# Altium schematic sheet 电源.SchDoc
size A4
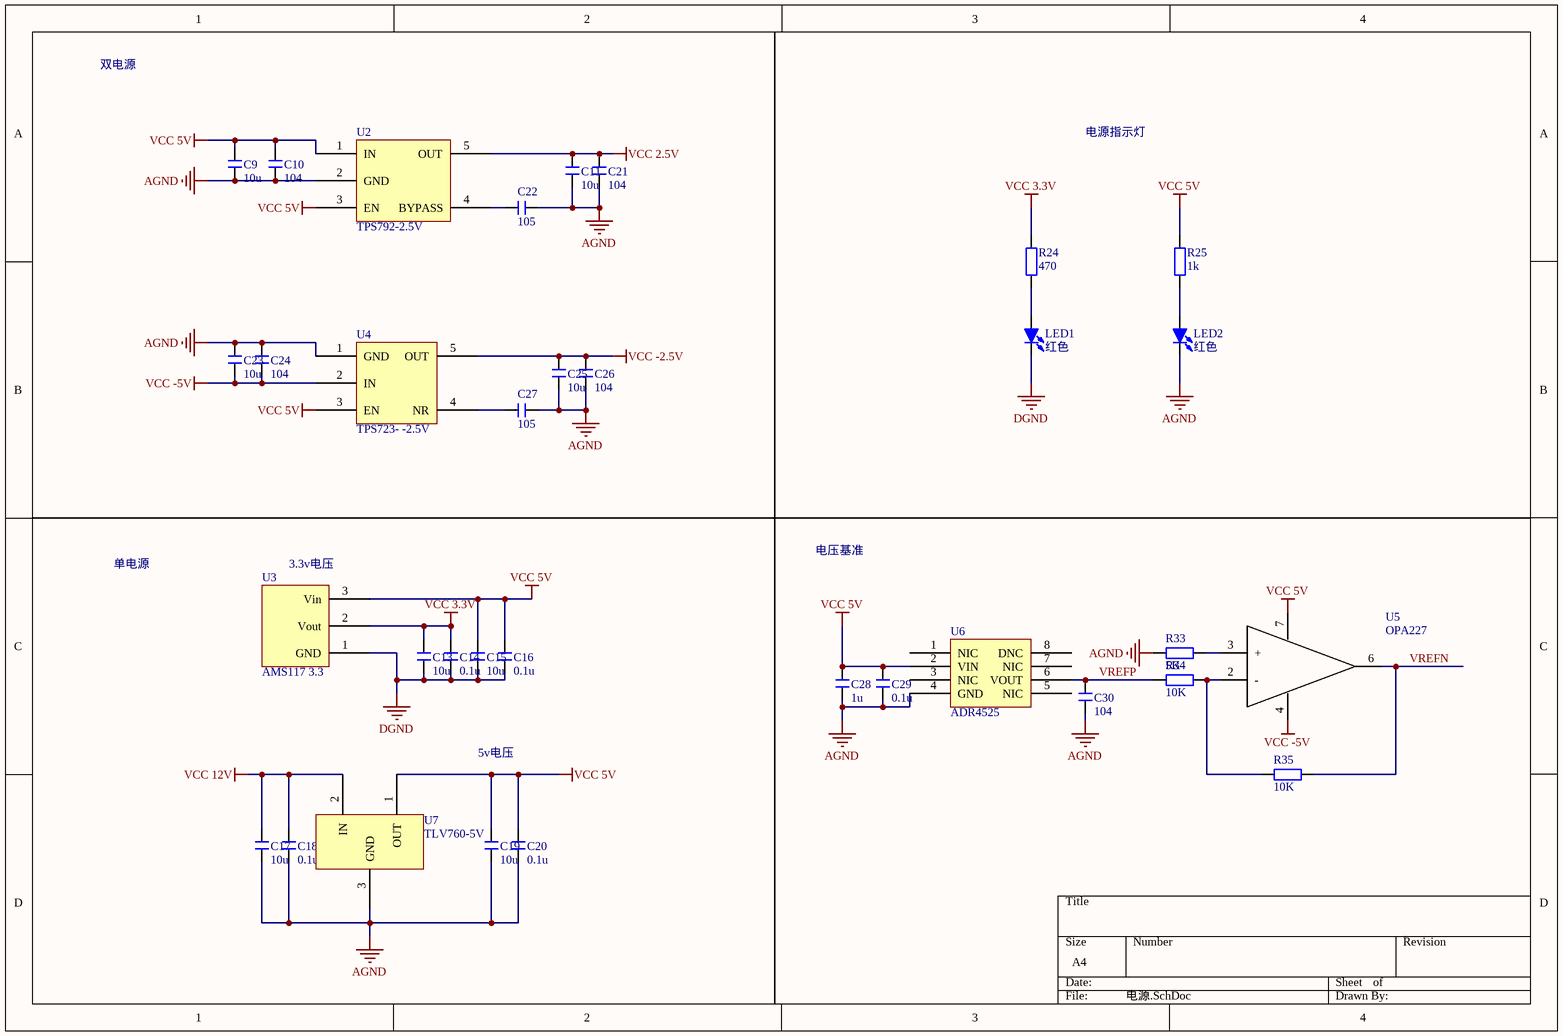
[diagram p0: 电源.SchDoc]

## Parts
C9  10u  [C 0805_L]
C10  104  [C 0805_L]
C11  10u  [C 0805_L]
C13  10u  [C 0805_L]
C14  0.1u  [C 0805_L]
C15  10u  [C 0805_L]
C16  0.1u  [C 0805_L]
C17  10u  [C 0805_L]
C18  0.1u  [C 0805_L]
C19  10u  [C 0805_L]
C20  0.1u  [C 0805_L]
C21  104  [C 0805_L]
C22  105  [C 0805_L]
C23  10u  [C 0805_L]
C24  104  [C 0805_L]
C25  10u  [C 0805_L]
C26  104  [C 0805_L]
C27  105  [C 0805_L]
C28  1u  [C 0805_L]
C29  0.1u  [C 0805_L]
C30  104  [C 0805_L]
LED1  红色  [LED 0805G]
LED2  红色  [LED 0805G]
R24  470  [R 0805_L]
R25  1k  [R 0805_L]
R33  5K  [R 0805_L]
R34  10K  [R 0805_L]
R35  10K  [R 0805_L]
U2  TPS792-2.5V  [SOT23-5N]
U3  AMS117 3.3  [SOT223_N]
U4  TPS723- -2.5V  [SOT23-5N]
U5  OPA227  [SOP8_N]
U6  ADR4525  [SOP8_N]
U7  TLV760-5V  [SOT23-3N]

## Nets
AGND: C9.1 C10.1 C11.1 C17.1 C18.1 C19.1 C20.1 C21.1 C22.2 C23.2 C24.2 C25.1 C26.1 C27.2 C28.1 C29.1 C30.1 LED2.2(K) R33.2 U2.2(GND) U4.1(GND) U6.4(GND) U7.3(GND)
DGND: C13.1 C14.1 C15.1 C16.1 LED1.2(K) U3.1(GND)
VCC 2.5V: C11.2 C21.2 U2.5(OUT)
VCC 3.3V: C13.2 C14.2 R24.2 U3.2(Vout)
VCC 5V: C9.2 C10.2 C15.2 C16.2 C19.2 C20.2 C28.2 C29.2 R25.2 U2.1(IN) U2.3(EN) U3.3(Vin) U4.3(EN) U5.7(VCC) U6.2(VIN) U7.1(OUT)
VCC 12V: C17.2 C18.2 U7.2(IN)
VCC -2.5V: C25.2 C26.2 U4.5(OUT)
VCC -5V: C23.1 C24.1 U4.2(IN) U5.4(VSS)
VREFN: R35.2 U5.6(UOT)
VREFP: C30.2 R34.1 U6.6(VOUT)
NetC22_1: C22.1 U2.4(BYPASS)
NetC27_1: C27.1 U4.4(NR)
NetLED1_1: LED1.1(A) R24.1
NetLED2_1: LED2.1(A) R25.1
NetR33_1: R33.1 U5.3(+)
NetR34_2: R34.2 R35.1 U5.2(-)

Not connected (* = marked no-connect by the designer): U6 1(NIC) 3(NIC) 5(NIC) 7(NIC) 8(DNC)

## Notes on the sheet
- 双电源
- 电源指示灯
- 单电源
- (near U3) 3.3v电压
- 电压基准
- 5v电压

## Library data of the parts
C9-C11 C13-C30 = C: 无极性贴片电容; 版权归属: 源创客; BOM名称: 无极性贴片电容; 学习资源: www.ooocke.com
LED1 LED2 = LED-SMD: 贴片LED; 版权归属: 源创客; BOM名称: 贴片LED; 学习资源: www.ooocke.com
R24 R25 R33-R35 = R: 贴片电阻; 版权归属: 源创客; BOM名称: 贴片电阻; 学习资源: www.ooocke.com
U3 = AMS117
U4 = TPS723-  -2.5V
U5 = OP27
U6 = ADR45
U7 = TLV760